# Altium schematic sheet POWER SCH.SchDoc (part 3 of 3)
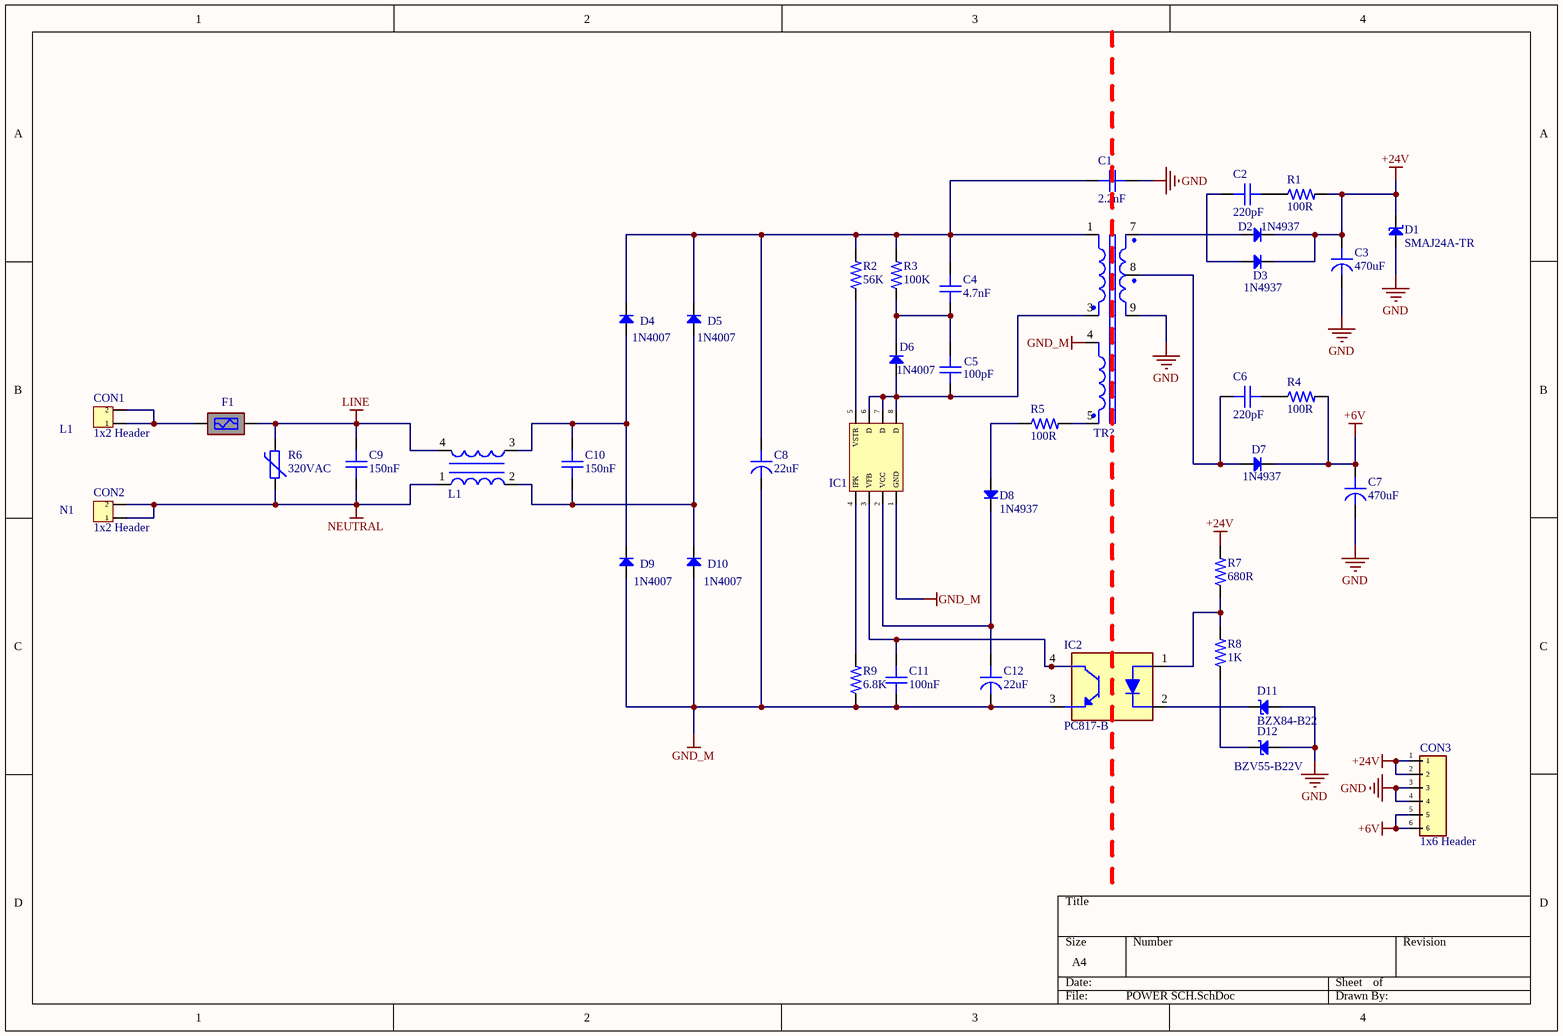
[diagram p2: POWER SCH.SchDoc]

## Library data of the parts (continued)
R7 = CRCW0805680RJNEA: Resistor;  Thick Film;  680 Ohms;  0.125 W;  5%;  SMT;  0805;  TCR 73 ppm/DegC;  Tape and Reel; Manufacturer: Vishay Dale; Component: 14; Temperature Coefficient: 200ppm/°C; Max Power Dissipation: 125mW; Voltage Rating: 150V; Manufacturer Part Number: CRCW0805680RJNEA; Supplier 1: Digi-Key; Supplier Part Number 1: 541-680ACT-ND; RoHS: Yes; Category: Chip SMD Resistors; Stock 1: 19628; Pricing 1: 1=0,10000, 10=0,03800, 100=0,01560, 1000=0,00702, 2500=0,00610 (USD); Case/Package: 0805; Number of Pins: 2; Weight: 0.000194oz; Case Code (Imperial): 0805; Case Code (Metric): 2012; Contact Plating: Tin; Min Operating Temperature: -55°C; Max Operating Temperature: 155°C; Resistance: 680R; Tolerance: 5%; Packaging: Tape and Reel; Composition: Thick Film; Number of Terminations: 2; Features: Automotive AEC-Q200; Power Rating: 125mW; Termination: SMD/SMT; Package Quantity: 1; Voltage Rating (DC): 150V; Military Standard: Not; Length: 2mm; Height: 0.45mm; Width: 1.25mm; Depth: 1.25mm; Radiation Hardening: No; Lead Free: Lead Free; REACH SVHC: Unknown; ComponentLink1URL: https://datasheet.ciiva.com/17159/dcrcwe3-17159253.pdf?src-supplier=Avnet+Europe; ComponentLink1Description: https://datasheet.ciiva.com/17159/dcrcwe3-17159253.pdf?src-supplier=Avnet+Europe; ComponentLink2URL: https://datasheet.ciiva.com/2464/dcrcwe3-2464294.pdf?src-supplier=Digi-Key; ComponentLink2Description: https://datasheet.ciiva.com/2464/dcrcwe3-2464294.pdf?src-supplier=Digi-Key; ComponentLink3URL: https://datasheet.ciiva.com/2464/dcrcwe3-2464295.pdf?src-supplier=Digi-Key; ComponentLink3Description: https://datasheet.ciiva.com/2464/dcrcwe3-2464295.pdf?src-supplier=Digi-Key; ComponentLink4URL: https://datasheet.ciiva.com/2464/dcrcwe3-2464296.pdf?src-supplier=Digi-Key; ComponentLink4Description: https://datasheet.ciiva.com/2464/dcrcwe3-2464296.pdf?src-supplier=Digi-Key; ComponentLink5URL: https://datasheet.ciiva.com/8923/dcrcwe3-8923242.pdf?src-supplier=Avnet; ComponentLink5Description: https://datasheet.ciiva.com/8923/dcrcwe3-8923242.pdf?src-supplier=Avnet; ComponentLink6URL: https://datasheet.ciiva.com/8923/dcrcwe3-8923245.pdf?src-supplier=Avnet; ComponentLink6Description: https://datasheet.ciiva.com/8923/dcrcwe3-8923245.pdf?src-supplier=Avnet; ComponentLink7URL: https://datasheet.ciiva.com/16781/70201119-16781375.pdf?src-supplier=Allied+Electronics; ComponentLink7Description: https://datasheet.ciiva.com/16781/70201119-16781375.pdf?src-supplier=Allied+Electronics
R8 = CRCW08051K00FKEA: Res Thick Film 0805 1K Ohm 1% 0.125W(1/8W) ±100ppm/C Pad SMD Automotive T/R; Manufacturer: Vishay Dale; Component: 15; Resistance: 1kR; Temperature Coefficient: 100ppm/°C; Power Rating: 125mW; Voltage Rating: 150V; Manufacturer Part Number: CRCW08051K00FKEA; Supplier 1: Digi-Key; Supplier Part Number 1: 541-1.00KCCT-ND; RoHS: Yes; Category: Chip SMD Resistors; Stock 1: 304825; Pricing 1: 1=0,10000, 10=0,06000, 100=0,02450, 1000=0,01102, 2500=0,00957 (USD); Case/Package: 0805; Number of Pins: 2; Weight: 0.000194oz; Case Code (Imperial): 0805; Case Code (Metric): 2012; Contact Plating: Tin; Min Operating Temperature: -55°C; Max Operating Temperature: 155°C; Tolerance: 1%; Packaging: Tape and Reel; Composition: Thick Film; Termination: SMD/SMT; Package Quantity: 5000; Voltage Rating (DC): 150V; Military Standard: Not; Length: 2mm; Height: 0.45mm; Width: 1.25mm; Depth: 1.25mm; Radiation Hardening: No; Lead Free: Lead Free; REACH SVHC: Unknown; ComponentLink1URL: https://datasheet.ciiva.com/11808/0900766b80d98b26-11808530.pdf?src-supplier=RSComponents; ComponentLink1Description: https://datasheet.ciiva.com/11808/0900766b80d98b26-11808530.pdf?src-supplier=RSComponents; ComponentLink2URL: https://datasheet.ciiva.com/46381/1697337-46381606.pdf?src-supplier=Element14; ComponentLink2Description: https://datasheet.ciiva.com/46381/1697337-46381606.pdf?src-supplier=Element14; ComponentLink3URL: https://datasheet.ciiva.com/3258/dcrcwe3-3258215.pdf?src-supplier=Avnet; ComponentLink3Description: https://datasheet.ciiva.com/3258/dcrcwe3-3258215.pdf?src-supplier=Avnet; ComponentLink4URL: https://datasheet.ciiva.com/26312/fld-crcw-e3-data-en-26312922.pdf?src-supplier=Distrelec; ComponentLink4Description: https://datasheet.ciiva.com/26312/fld-crcw-e3-data-en-26312922.pdf?src-supplier=Distrelec; ComponentLink5URL: https://datasheet.ciiva.com/46441/1720486-46441626.pdf?src-supplier=Element14; ComponentLink5Description: https://datasheet.ciiva.com/46441/1720486-46441626.pdf?src-supplier=Element14; ComponentLink6URL: https://datasheet.ciiva.com/16213/dcrcwe3-16213643.pdf?src-supplier=Future+Electronics; ComponentLink6Description: https://datasheet.ciiva.com/16213/dcrcwe3-16213643.pdf?src-supplier=Future+Electronics; ComponentLink7URL: https://datasheet.ciiva.com/17204/dcrcwe3-17204396.pdf?src-supplier=Avnet+Europe; ComponentLink7Description: https://datasheet.ciiva.com/17204/dcrcwe3-17204396.pdf?src-supplier=Avnet+Europe
R9 = PTF566K8000QYEK: Res Metal Film 6.8K Ohm 0.02% 0.125W(1/8W) ±10ppm/C Conformal Coated AXL Bulk; Manufacturer: Vishay Semiconductors; Component: 18; Resistance: 6.8kR; Temperature Coefficient: 10ppm/°C; Manufacturer Part Number: PTF566K8000QYEK; Supplier 1: Avnet; Supplier Part Number 1: PTF566K8000QYEK; RoHS: Yes; Category: Through-Hole Resistors; Pricing 1: 100=2,92576, 200=2,85420, 400=2,81400, 600=2,73360, 800=2,67330 (USD); Mount: Through Hole; Case/Package: Conformal; Contact Plating: Tin,Matte; Min Operating Temperature: -55°C; Max Operating Temperature: 150°C; Tolerance: 0.02%; Packaging: Bulk; Composition: Metal Film; Termination: Axial; Military Standard: Not; Length: 7.62mm; Radiation Hardening: No; ComponentLink1URL: https://datasheet.ciiva.com/17039/ptf-17039642.pdf?src-supplier=Avnet+Europe; ComponentLink1Description: https://datasheet.ciiva.com/17039/ptf-17039642.pdf?src-supplier=Avnet+Europe; Diameter: 2.31mm
TR? = 125J: Audio Transformers / Signal Transformers Audio, Tube Output 2.5 or 4K Ohm, 8W; Manufacturer Part Number: 125J; Manufacturer: Hammond Manufacturing; Component: 8; Supplier 1: Digi-Key; Supplier Part Number 1: HM2525-ND; RoHS: Yes; Category: Transformers; Stock 1: 3; Pricing 1: 1=41,92000, 10=36,99000, 25=35,75720, 50=32,05800, 100=30,82500 (USD); Package Quantity: 1; Mount: Chassis Mount; Power Rating: 8W; Termination: Wire Leads